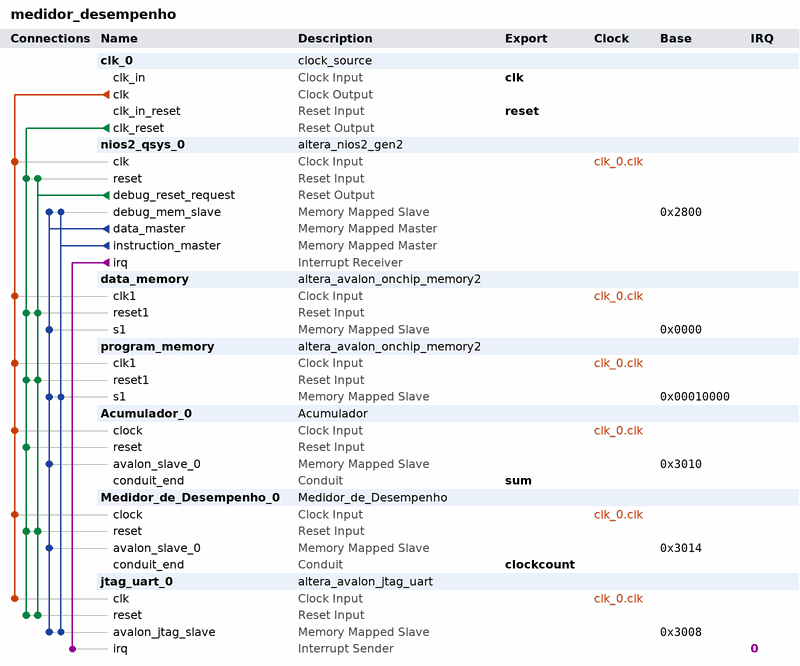
[diagram p0: system contents]
# Platform Designer (Qsys) system medidor_desempenho, Cyclone IV E EP4CE115F29C7
# Parameters at their usual value, and those the tool derives, are not listed.
package require -exact qsys 17.1
create_system medidor_desempenho
set_project_property DEVICE_FAMILY {Cyclone IV E}
set_project_property DEVICE EP4CE115F29C7

add_instance clk_0 clock_source 17.1
set_instance_parameter_value clk_0 clockFrequency 50000000

add_instance nios2_qsys_0 altera_nios2_gen2 17.1
set_instance_parameter_value nios2_qsys_0 dcache_size 2048
set_instance_parameter_value nios2_qsys_0 exceptionSlave program_memory.s1
set_instance_parameter_value nios2_qsys_0 icache_size 4096
set_instance_parameter_value nios2_qsys_0 impl Tiny
set_instance_parameter_value nios2_qsys_0 resetSlave program_memory.s1
set_instance_parameter_value nios2_qsys_0 setting_activateTrace true

add_instance data_memory altera_avalon_onchip_memory2 17.1
set_instance_parameter_value data_memory dataWidth 32
set_instance_parameter_value data_memory dualPort false
set_instance_parameter_value data_memory initMemContent true
set_instance_parameter_value data_memory initializationFileName ./memoria_dados.hex
set_instance_parameter_value data_memory memorySize 8192
set_instance_parameter_value data_memory useNonDefaultInitFile true

add_instance program_memory altera_avalon_onchip_memory2 17.1
set_instance_parameter_value program_memory dataWidth 32
set_instance_parameter_value program_memory dualPort false
set_instance_parameter_value program_memory initMemContent true
set_instance_parameter_value program_memory initializationFileName onchip_mem.hex
set_instance_parameter_value program_memory memorySize 32768

add_instance Acumulador_0 Acumulador 1.0

add_instance Medidor_de_Desempenho_0 Medidor_de_Desempenho 1.0

add_instance jtag_uart_0 altera_avalon_jtag_uart 17.1
set_instance_parameter_value jtag_uart_0 simInteractiveOptions NO_INTERACTIVE_WINDOWS

# connections
add_connection clk_0.clk Acumulador_0.clock clock
add_connection clk_0.clk data_memory.clk1 clock
add_connection clk_0.clk jtag_uart_0.clk clock
add_connection clk_0.clk Medidor_de_Desempenho_0.clock clock
add_connection clk_0.clk nios2_qsys_0.clk clock
add_connection clk_0.clk program_memory.clk1 clock
add_connection clk_0.clk_reset Acumulador_0.reset reset
add_connection clk_0.clk_reset data_memory.reset1 reset
add_connection clk_0.clk_reset jtag_uart_0.reset reset
add_connection clk_0.clk_reset Medidor_de_Desempenho_0.reset reset
add_connection clk_0.clk_reset nios2_qsys_0.reset reset
add_connection clk_0.clk_reset program_memory.reset1 reset
add_connection nios2_qsys_0.debug_reset_request data_memory.reset1 reset
add_connection nios2_qsys_0.debug_reset_request jtag_uart_0.reset reset
add_connection nios2_qsys_0.debug_reset_request Medidor_de_Desempenho_0.reset reset
add_connection nios2_qsys_0.debug_reset_request nios2_qsys_0.reset reset
add_connection nios2_qsys_0.debug_reset_request program_memory.reset1 reset
add_connection nios2_qsys_0.data_master Acumulador_0.avalon_slave_0 avalon
set_connection_parameter_value nios2_qsys_0.data_master/Acumulador_0.avalon_slave_0 baseAddress 0x3010
add_connection nios2_qsys_0.data_master data_memory.s1 avalon
set_connection_parameter_value nios2_qsys_0.data_master/data_memory.s1 baseAddress 0x0000
add_connection nios2_qsys_0.data_master jtag_uart_0.avalon_jtag_slave avalon
set_connection_parameter_value nios2_qsys_0.data_master/jtag_uart_0.avalon_jtag_slave baseAddress 0x3008
add_connection nios2_qsys_0.data_master Medidor_de_Desempenho_0.avalon_slave_0 avalon
set_connection_parameter_value nios2_qsys_0.data_master/Medidor_de_Desempenho_0.avalon_slave_0 baseAddress 0x3014
add_connection nios2_qsys_0.data_master nios2_qsys_0.debug_mem_slave avalon
set_connection_parameter_value nios2_qsys_0.data_master/nios2_qsys_0.debug_mem_slave baseAddress 0x2800
add_connection nios2_qsys_0.data_master program_memory.s1 avalon
set_connection_parameter_value nios2_qsys_0.data_master/program_memory.s1 baseAddress 0x00010000
add_connection nios2_qsys_0.instruction_master jtag_uart_0.avalon_jtag_slave avalon
set_connection_parameter_value nios2_qsys_0.instruction_master/jtag_uart_0.avalon_jtag_slave baseAddress 0x3008
add_connection nios2_qsys_0.instruction_master nios2_qsys_0.debug_mem_slave avalon
set_connection_parameter_value nios2_qsys_0.instruction_master/nios2_qsys_0.debug_mem_slave baseAddress 0x2800
add_connection nios2_qsys_0.instruction_master program_memory.s1 avalon
set_connection_parameter_value nios2_qsys_0.instruction_master/program_memory.s1 baseAddress 0x00010000
add_connection nios2_qsys_0.irq jtag_uart_0.irq interrupt
set_connection_parameter_value nios2_qsys_0.irq/jtag_uart_0.irq irqNumber 0

# exported interfaces
add_interface clk clock sink
set_interface_property clk EXPORT_OF clk_0.clk_in
add_interface clockcount conduit end
set_interface_property clockcount EXPORT_OF Medidor_de_Desempenho_0.conduit_end
add_interface reset reset sink
set_interface_property reset EXPORT_OF clk_0.clk_in_reset
add_interface sum conduit end
set_interface_property sum EXPORT_OF Acumulador_0.conduit_end

set_interconnect_requirement {$system} qsys_mm.clockCrossingAdapter HANDSHAKE
set_interconnect_requirement {$system} qsys_mm.enableEccProtection FALSE
set_interconnect_requirement {$system} qsys_mm.insertDefaultSlave FALSE
set_interconnect_requirement {$system} qsys_mm.maxAdditionalLatency 1

save_system medidor_desempenho.qsys
